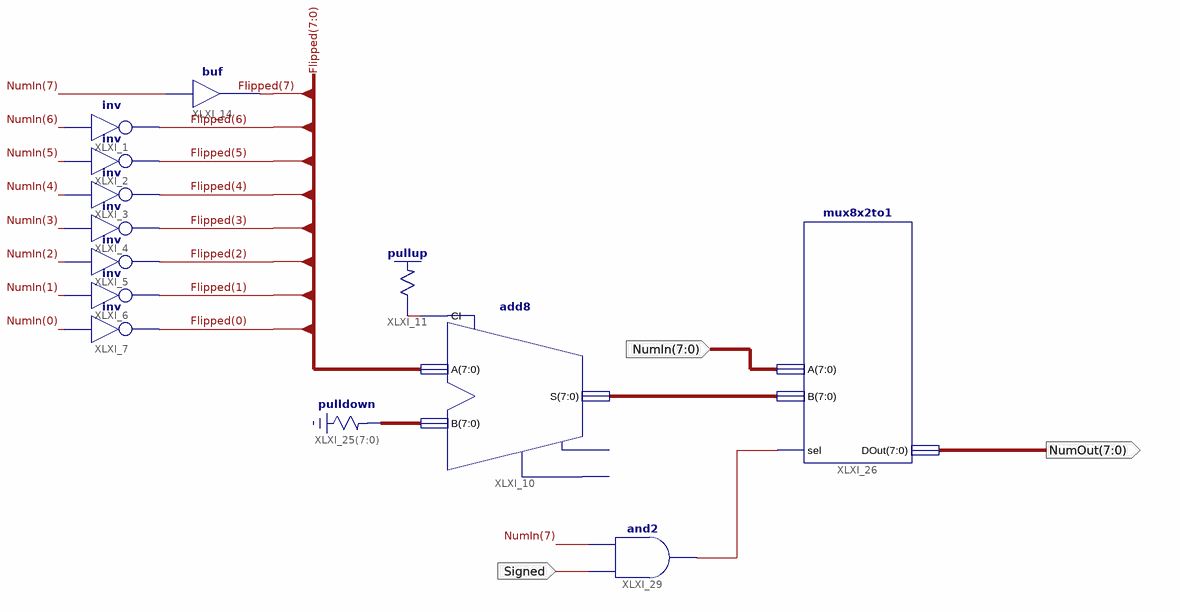
[diagram p0: schematic sheet 1]
// Xilinx ISE schematic TwosComp.sch (spartan3e) as structural Verilog: 13 symbols, 3 ports
module TwosComp (
  input  [7:0] NumIn,
  input  Signed,
  output [7:0] NumOut
);

  wire XLXN_17, XLXN_34;
  wire [7:0] Flipped, XLXN_23, XLXN_25;

  not XLXI_1 (Flipped[6], NumIn[6]);
  not XLXI_2 (Flipped[5], NumIn[5]);
  not XLXI_3 (Flipped[4], NumIn[4]);
  not XLXI_4 (Flipped[3], NumIn[3]);
  not XLXI_5 (Flipped[2], NumIn[2]);
  not XLXI_6 (Flipped[1], NumIn[1]);
  not XLXI_7 (Flipped[0], NumIn[0]);
  buf XLXI_14 (Flipped[7], NumIn[7]);
  add8 XLXI_10 (.A(Flipped), .B(XLXN_23), .CI(XLXN_17), .S(XLXN_25));  // open: CO, OFL
  \pullup  XLXI_11 (.O(XLXN_17));
  \pulldown  XLXI_25[7:0] (.O(XLXN_23));
  mux8x2to1 XLXI_26 (.A(NumIn), .B(XLXN_25), .sel(XLXN_34), .DOut(NumOut));
  and XLXI_29 (XLXN_34, Signed, NumIn[7]);
endmodule
